# EAGLE design FubarStep_v10 (EAGLE 6.4)
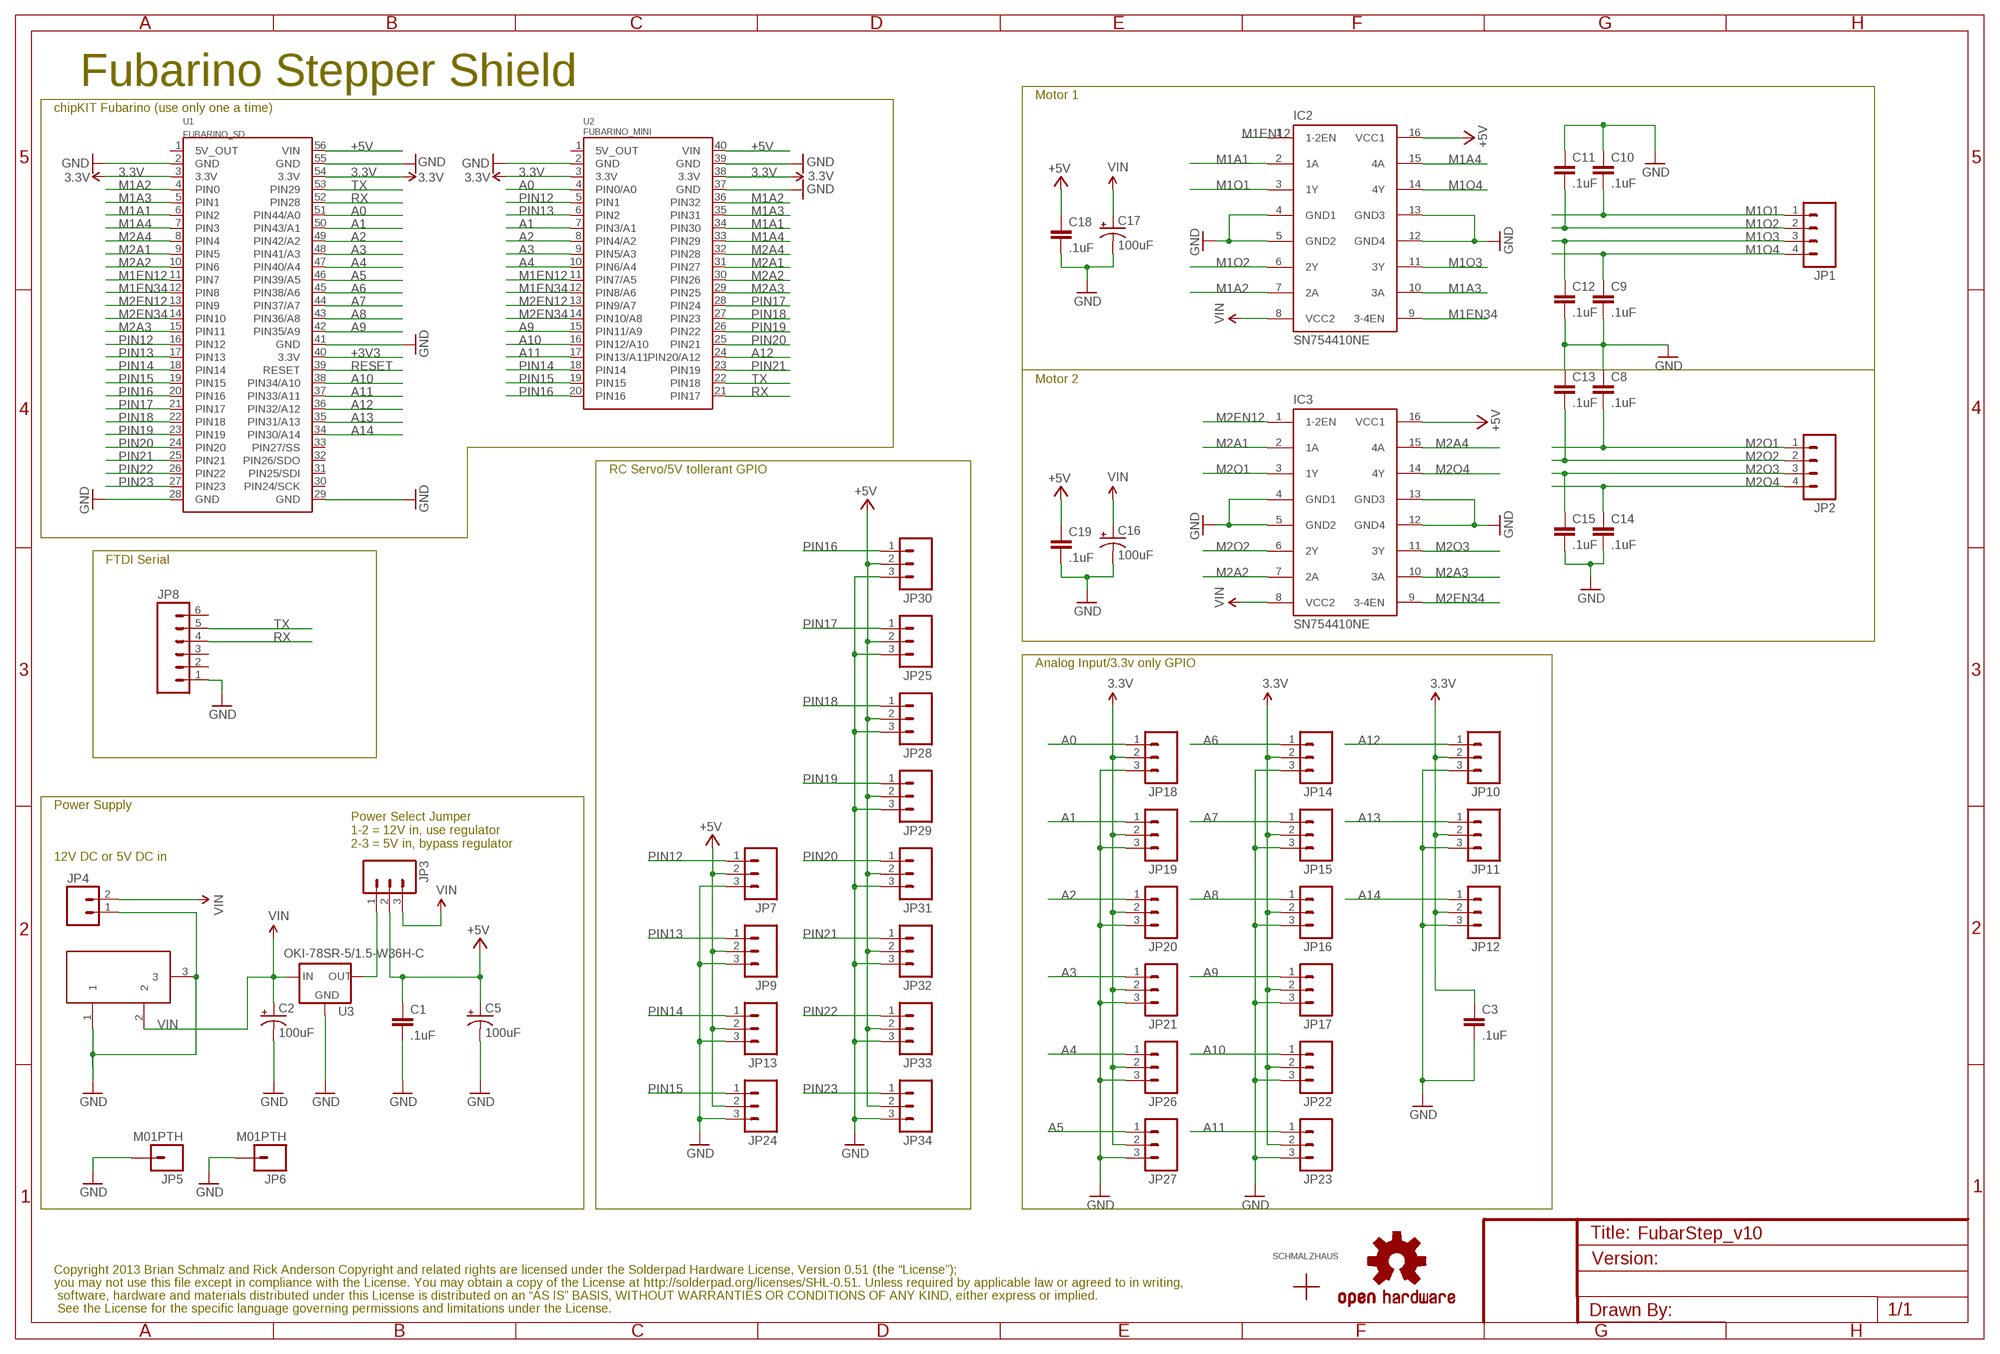
[diagram p0: schematic, sheet 1]

## Parts
C1  .1uF  CAPPTH  [CAP-PTH-SMALL]
C2  100uF  CAP_POLPTH1  [CPOL-RADIAL-100UF-25V]
C3  .1uF  CAPPTH  [CAP-PTH-SMALL]
C5  100uF  CAP_POLPTH1  [CPOL-RADIAL-100UF-25V]
C8  .1uF  CAPPTH  [CAP-PTH-SMALL]
C9  .1uF  CAPPTH  [CAP-PTH-SMALL]
C10  .1uF  CAPPTH  [CAP-PTH-SMALL]
C11  .1uF  CAPPTH  [CAP-PTH-SMALL]
C12  .1uF  CAPPTH  [CAP-PTH-SMALL]
C13  .1uF  CAPPTH  [CAP-PTH-SMALL]
C14  .1uF  CAPPTH  [CAP-PTH-SMALL]
C15  .1uF  CAPPTH  [CAP-PTH-SMALL]
C16  100uF  CAP_POLPTH1  [CPOL-RADIAL-100UF-25V]
C17  100uF  CAP_POLPTH1  [CPOL-RADIAL-100UF-25V]
C18  .1uF  CAPPTH  [CAP-PTH-SMALL]
C19  .1uF  CAPPTH  [CAP-PTH-SMALL]
IC2  SN754410NE  L293E  [DIL16]
IC3  SN754410NE  L293E  [DIL16]
JP1  M04SCREW_LOCK  [SCREWTERMINAL-3.5MM-4_LOCK]
JP2  M04SCREW_LOCK  [SCREWTERMINAL-3.5MM-4_LOCK]
JP3  M03PTH  [1X03]
JP4  M023.5MM  [SCREWTERMINAL-3.5MM-2]
JP5  M01PTH  [1X01]
JP6  M01PTH  [1X01]
JP7  M03PTH  [1X03]
JP8  M06LOCK  [1X06_LOCK]
JP9  M03PTH  [1X03]
JP10  M03PTH  [1X03]
JP11  M03PTH  [1X03]
JP12  M03PTH  [1X03]
JP13  M03PTH  [1X03]
JP14  M03PTH  [1X03]
JP15  M03PTH  [1X03]
JP16  M03PTH  [1X03]
JP17  M03PTH  [1X03]
JP18  M03PTH  [1X03]
JP19  M03PTH  [1X03]
JP20  M03PTH  [1X03]
JP21  M03PTH  [1X03]
JP22  M03PTH  [1X03]
JP23  M03PTH  [1X03]
JP24  M03PTH  [1X03]
JP25  M03PTH  [1X03]
JP26  M03PTH  [1X03]
JP27  M03PTH  [1X03]
JP28  M03PTH  [1X03]
JP29  M03PTH  [1X03]
JP30  M03PTH  [1X03]
JP31  M03PTH  [1X03]
JP32  M03PTH  [1X03]
JP33  M03PTH  [1X03]
JP34  M03PTH  [1X03]
LOGO1  OSHW-LOGOM  [OSHW-LOGO-M]
U1  FUBARINO_SD  [FUBARINO_SD]
U2  FUBARINO_MINI  [FUBARINO_MINI]
U3  OKI-78SR-5/1.5-W36H-C  V_REG_78XXSINK  [TO220-IGO]
U$1  SCHMALZHAUSSCHMALZHAUS_SMALL  [SCHMALZHAUS_SMALL]
X1  DC21MMX  [DC-21MM]

## Nets
3.3V: C3.1 JP10.2 JP11.2 JP12.2 JP14.2 JP15.2 JP16.2 JP17.2 JP18.2 JP19.2 JP20.2 JP21.2 JP22.2 JP23.2 JP26.2 JP27.2 U1.3(3.3V) U1.54(3.3V) U2.3(3.3V) U2.38(3.3V)
+3V3: U1.40(3.3V)
+5V: C1.1 C5.1(+) C18.1 C19.1 IC2.16(VCC1) IC3.16(VCC1) JP3.2 JP7.2 JP9.2 JP13.2 JP24.2 JP25.2 JP28.2 JP29.2 JP30.2 JP31.2 JP32.2 JP33.2 JP34.2 U1.56(VIN) U2.40(VIN)
A0: JP18.1 U1.51(PIN44/A0) U2.4(PIN0/A0)
A1: JP19.1 U1.50(PIN43/A1) U2.7(PIN3/A1)
A2: JP20.1 U1.49(PIN42/A2) U2.8(PIN4/A2)
A3: JP21.1 U1.48(PIN41/A3) U2.9(PIN5/A3)
A4: JP26.1 U1.47(PIN40/A4) U2.10(PIN6/A4)
A5: JP27.1 U1.46(PIN39/A5)
A6: JP14.1 U1.45(PIN38/A6)
A7: JP15.1 U1.44(PIN37/A7)
A8: JP16.1 U1.43(PIN36/A8)
A9: JP17.1 U1.42(PIN35/A9) U2.15(PIN11/A9)
A10: JP22.1 U1.38(PIN34/A10) U2.16(PIN12/A10)
A11: JP23.1 U1.37(PIN33/A11) U2.17(PIN13/A11)
A12: JP10.1 U1.36(PIN32/A12) U2.24(PIN20/A12)
A13: JP11.1 U1.35(PIN31/A13)
A14: JP12.1 U1.34(PIN30/A14)
GND: C1.2 C2.2(-) C3.2 C5.2(-) C8.1 C9.2 C10.1 C11.1 C12.2 C13.1 C14.2 C15.2 C16.2(-) C17.2(-) C18.2 C19.2 IC2.4(GND1) IC2.5(GND2) IC2.12(GND4) IC2.13(GND3) IC3.4(GND1) IC3.5(GND2) IC3.12(GND4) IC3.13(GND3) JP4.1 JP5.1 JP6.1 JP7.3 JP8.1 JP9.3 JP10.3 JP11.3 JP12.3 JP13.3 JP14.3 JP15.3 JP16.3 JP17.3 JP18.3 JP19.3 JP20.3 JP21.3 JP22.3 JP23.3 JP24.3 JP25.3 JP26.3 JP27.3 JP28.3 JP29.3 JP30.3 JP31.3 JP32.3 JP33.3 JP34.3 U1.2(GND) U1.28(GND) U1.29(GND) U1.41(GND) U1.55(GND) U2.2(GND) U2.37(GND) U2.39(GND) U3.GND X1.1 X1.3
M1A1: IC2.2(1A) U1.6(PIN2) U2.34(PIN30)
M1A2: IC2.7(2A) U1.4(PIN0) U2.36(PIN32)
M1A3: IC2.10(3A) U1.5(PIN1) U2.35(PIN31)
M1A4: IC2.15(4A) U1.7(PIN3) U2.33(PIN29)
M1EN12: IC2.1(1-2EN) U1.11(PIN7) U2.11(PIN7/A5)
M1EN34: IC2.9(3-4EN) U1.12(PIN8) U2.12(PIN8/A6)
M1O1: C10.2 IC2.3(1Y) JP1.1
M1O2: C11.2 IC2.6(2Y) JP1.2
M1O3: C12.1 IC2.11(3Y) JP1.3
M1O4: C9.1 IC2.14(4Y) JP1.4
M2A1: IC3.2(1A) U1.9(PIN5) U2.31(PIN27)
M2A2: IC3.7(2A) U1.10(PIN6) U2.30(PIN26)
M2A3: IC3.10(3A) U1.15(PIN11) U2.29(PIN25)
M2A4: IC3.15(4A) U1.8(PIN4) U2.32(PIN28)
M2EN12: IC3.1(1-2EN) U1.13(PIN9) U2.13(PIN9/A7)
M2EN34: IC3.9(3-4EN) U1.14(PIN10) U2.14(PIN10/A8)
M2O1: C8.2 IC3.3(1Y) JP2.1
M2O2: C13.2 IC3.6(2Y) JP2.2
M2O3: C15.1 IC3.11(3Y) JP2.3
M2O4: C14.1 IC3.14(4Y) JP2.4
N$2: JP3.1 U3.OUT
PIN12: JP7.1 U1.16(PIN12) U2.5(PIN1)
PIN13: JP9.1 U1.17(PIN13) U2.6(PIN2)
PIN14: JP13.1 U1.18(PIN14) U2.18(PIN14)
PIN15: JP24.1 U1.19(PIN15) U2.19(PIN15)
PIN16: JP30.1 U1.20(PIN16) U2.20(PIN16)
PIN17: JP25.1 U1.21(PIN17) U2.28(PIN24)
PIN18: JP28.1 U1.22(PIN18) U2.27(PIN23)
PIN19: JP29.1 U1.23(PIN19) U2.26(PIN22)
PIN20: JP31.1 U1.24(PIN20) U2.25(PIN21)
PIN21: JP32.1 U1.25(PIN21) U2.23(PIN19)
PIN22: JP33.1 U1.26(PIN22)
PIN23: JP34.1 U1.27(PIN23)
RESET: U1.39(RESET)
RX: JP8.4 U1.52(PIN28) U2.21(PIN17)
TX: JP8.5 U1.53(PIN29) U2.22(PIN18)
VIN: C2.1(+) C16.1(+) C17.1(+) IC2.8(VCC2) IC3.8(VCC2) JP3.3 JP4.2 U3.IN X1.2
Unconnected: JP8.2 JP8.3 JP8.6 U1.1(5V_OUT) U1.30(PIN24/SCK) U1.31(PIN25/SDI) U1.32(PIN26/SDO) U1.33(PIN27/SS) U2.1(5V_OUT)

## Notes on the sheet
- Fubarino Stepper Shield
- Motor 1
- chipKIT Fubarino (use only one a time)
- Motor 2
- RC Servo/5V tollerant GPIO
- FTDI Serial
- Analog Input/3.3v only GPIO
- Power Supply
- Power Select Jumper
  1-2 = 12V in, use regulator
  2-3 = 5V in, bypass regulator
- 12V DC or 5V DC in
- Copyright 2013 Brian Schmalz and Rick Anderson Copyright and related rights are licensed under the Solderpad Hardware License, Version 0.51 (the “License”);
- you may not use this file except in compliance with the License. You may obtain a copy of the License at http://solderpad.org/licenses/SHL-0.51. Unless required by applicable law or agreed to in writing,
- software, hardware and materials distributed under this License is distributed on an “AS IS” BASIS, WITHOUT WARRANTIES OR CONDITIONS OF ANY KIND, either express or implied.
- See the License for the specific language governing permissions and limitations under the License.

## Library data of the parts
C1 C3 C8-C15 C18 C19 = SparkFun-Capacitors:CAP: Capacitor Standard 0603 ceramic capacitor, and 0.1" leaded capacitor.
C2 C5 C16 C17 = SparkFun-Capacitors:CAP_POL: Capacitor Polarized These are standard SMD and PTH capacitors. Normally 10uF, 47uF, and 100uF in electrolytic and tantalum varieties. Always verify the external diameter of the through hole cap, it varies with capacity, voltage, and manufacturer. The EIA devices should be standard.
IC2 IC3 = texas:L293E: TI DEVICE; MF: Arrow Electronics; MPN: L293E; OC_FARNELL: 1467711; OC_NEWARK: 89K0732
JP1 JP2 = SparkFun-Connectors:M04: Header 4 Standard 4-pin 0.1" header. Use with straight break away headers (SKU : PRT-00116), right angle break away headers (PRT-00553), swiss pins (PRT-00743), machine pins (PRT-00117), and female headers (PRT-00115). Molex polarized connector foot print use with SKU : PRT-08231 with associated crimp pins and housings. 1MM SMD Version SKU: PRT-10208
JP3 JP7 JP9-JP34 = SparkFun-Connectors:M03: Header 3 Standard 3-pin 0.1" header. Use with straight break away headers (SKU : PRT-00116), right angle break away headers (PRT-00553), swiss pins (PRT-00743), machine pins (PRT-00117), and female headers (PRT-00115). Molex polarized connector foot print use with SKU : PRT-08232 with associated crimp pins and housings.
JP4 = SparkFun-Connectors:M02: Header 2 Standard 2-pin 0.1" header. Use with straight break away headers (SKU : PRT-00116), right angle break away headers (PRT-00553), swiss pins (PRT-00743), machine pins (PRT-00117), and female headers (PRT-00115). Molex polarized connector foot print use with SKU : PRT-08233 with associated crimp pins and housings.
JP5 JP6 = SparkFun-Connectors:M01: Header 1 Standard 1-pin 0.1" header. Use with straight break away headers (SKU : PRT-00116), right angle break away headers (PRT-00553), swiss pins (PRT-00743), machine pins (PRT-00117), and female headers (PRT-00115).
JP8 = SparkFun-Connectors:M06: Header 6 Standard 6-pin 0.1" header. Use with straight break away headers (SKU : PRT-00116), right angle break away headers (PRT-00553), swiss pins (PRT-00743), machine pins (PRT-00117), and female headers (PRT-00115). Molex polarized connector foot print use with SKU : PRT-08094 with associated crimp pins and housings. NOTES ON THE VARIANTS LOCK and LOCK_LONGPADS... This footprint was designed to help hold the alignment of a through-hole component (i.e. 6-pin header) while soldering it into place. You may notice that each hole has been shifted either up or down by 0.005 of an inch from it's more standard position (which is a perfectly straight line). This slight alteration caused the pins (the squares in the middle) to touch the edges of the holes. Because they are alternating, it causes a "brace" to hold the component in place. 0.005 has proven to be the perfect amount of "off-center" position when using our standard breakaway headers. Although looks a little odd when you look at the bare footprint, once you have a header in there, the alteration is very hard to notice. Also, if you push a header all the way into place, it is covered up entirely on the bottom side. This idea of altering the position of holes to aid alignment will be further integrated into the Sparkfun Library for other footprints. It can help hold any component with 3 or more connection pins.
LOGO1 = SparkFun-Aesthetics:OSHW-LOGO: Open Source Hardware Logo This logo indicates the piece of hardware it is found on incorporates a OSHW license and/or adheres to the definition of open source hardware found here: http://freedomdefined.org/OSHW
U1 = SchmalzHausPublic:FUBARINO_SD
U2 = SchmalzHausPublic:FUBARINO_MINI
U3 = SparkFun-PowerIC:V_REG_78XX: Voltage Regulator Standard 7805 5V regulator. IGO (Input Ground Output). Spark Fun Electronics SKU : COM-00107
U$1 = SchmalzHaus:SCHMALZHAUS
X1 = powersupply:DC21MM

## Net classes
0 default: width 0.152 mm, drill 0.305 mm, clearance 0.152 mm

## Board
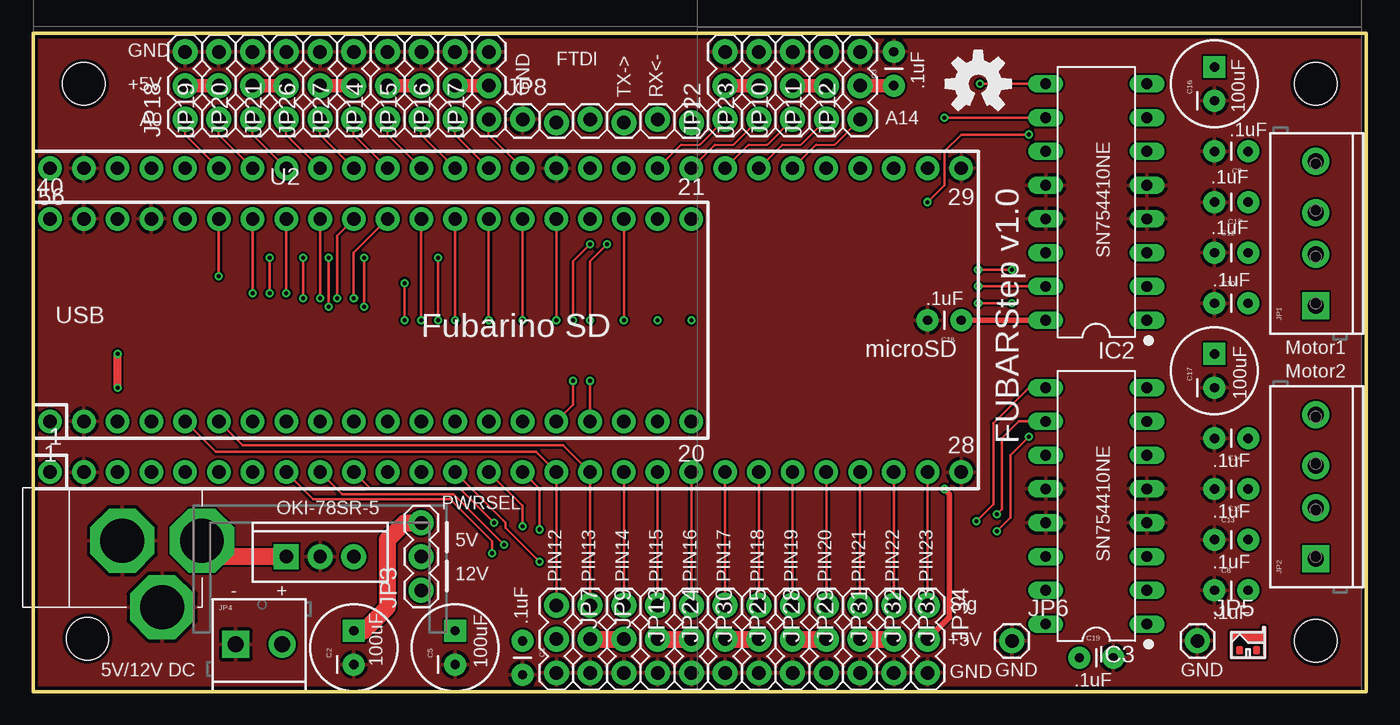
[diagram p1: board, top side]
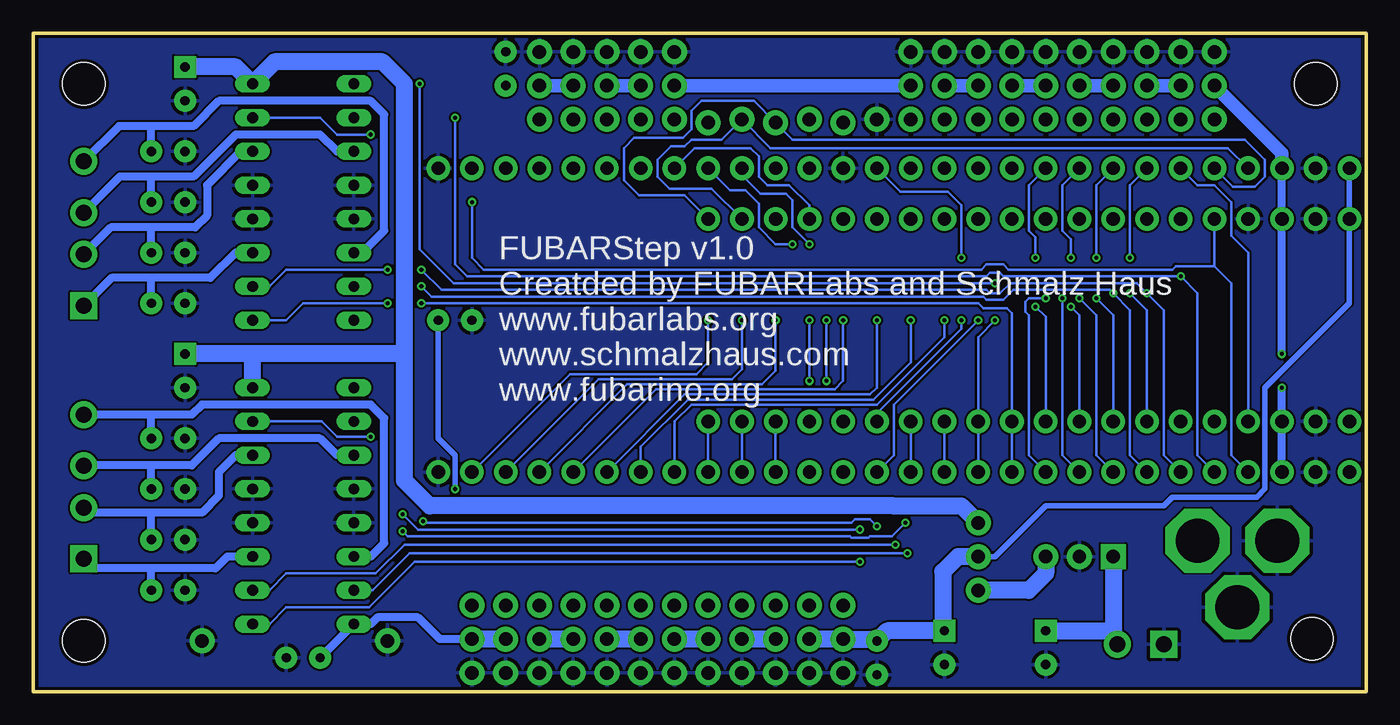
[diagram p2: board, bottom side, seen from below]

Size 100.33 x 49.53 mm. Coordinates in mm from the lower left corner, seen from the top.
Outline: 0,49.53 100.33,49.53 100.33,0 0,0 0,49.53
Copper layers (1*16): Top 0.035mm / dielectric 1.5mm / Bottom 0.035mm
Design rules "Fusion_eagle_rule_v1.1 *": minimum track width 6mil, minimum drill 12mil, track to track 6mil, track to pad 6mil, pad to pad 6mil, via to via 6mil, smd to smd 0mil, copper to edge 10mil, drill to drill 10mil, minimum pad ring 10mil, minimum via ring 6mil, stop-mask expansion 2mil, vias tented up to drill 100mil, thermal gap 10mil
Holes 3.2 mm at 96.52,45.72 96.52,3.81 3.81,45.72 4.08,3.98

### Footprints (pad centres in the part's own frame; a part is rotated, then mirrored left to right if it is on the bottom)
CAP-PTH-SMALL = drill 0.7 pad 1.651: 1 0,0; 2 2.54,0
CPOL-RADIAL-100UF-25V = drill 0.7 pad 1.651 square: 1 1.27,0 | drill 0.7 pad 1.651: 2 -1.27,0
DIL16 = drill 0.813 long: 1 -8.89,-3.81; 2 -6.35,-3.81; 3 -3.81,-3.81; 4 -1.27,-3.81; 5 1.27,-3.81; 6 3.81,-3.81; 7 6.35,-3.81; 8 8.89,-3.81; 9 8.89,3.81; 10 6.35,3.81; 11 3.81,3.81; 12 1.27,3.81; 13 -1.27,3.81; 14 -3.81,3.81; 15 -6.35,3.81; 16 -8.89,3.81
SCREWTERMINAL-3.5MM-4_LOCK = drill 1.2 pad 2.032 square: 1 -0.178,0 | drill 1.2 pad 2.032: 2 3.678,0; 3 6.822,0; 4 10.678,0
1X03 = drill 1.016 pad 1.88: 1 0,0; 2 2.54,0; 3 5.08,0
SCREWTERMINAL-3.5MM-2 = drill 1.2 pad 2.032 square: 1 0,0 | drill 1.2 pad 2.032: 2 3.5,0
1X01 = drill 1.016 pad 1.88: 1 0,0
1X06_LOCK = drill 1.016 pad 1.88: 1 0,0; 2 2.54,-0.254; 3 5.08,0; 4 7.62,-0.254; 5 10.16,0; 6 12.7,-0.254
FUBARINO_SD = drill 1 pad 1.778: 1 -34.29,-11.43; 2 -31.75,-11.43; 3 -29.21,-11.43; 4 -26.67,-11.43; 5 -24.13,-11.43; 6 -21.59,-11.43; 7 -19.05,-11.43; 8 -16.51,-11.43; 9 -13.97,-11.43; 10 -11.43,-11.43; 11 -8.89,-11.43; 12 -6.35,-11.43; 13 -3.81,-11.43; 14 -1.27,-11.43; 15 1.27,-11.43; 16 3.81,-11.43; 17 6.35,-11.43; 18 8.89,-11.43; 19 11.43,-11.43; 20 13.97,-11.43; 21 16.51,-11.43; 22 19.05,-11.43; 23 21.59,-11.43; 24 24.13,-11.43; 25 26.67,-11.43; 26 29.21,-11.43; 27 31.75,-11.43; 28 34.29,-11.43; 29 34.29,11.43; 30 31.75,11.43; 31 29.21,11.43; 32 26.67,11.43; 33 24.13,11.43; 34 21.59,11.43; 35 19.05,11.43; 36 16.51,11.43; 37 13.97,11.43; 38 11.43,11.43; 39 8.89,11.43; 40 6.35,11.43; 41 3.81,11.43; 42 1.27,11.43; 43 -1.27,11.43; 44 -3.81,11.43; 45 -6.35,11.43; 46 -8.89,11.43; 47 -11.43,11.43; 48 -13.97,11.43; 49 -16.51,11.43; 50 -19.05,11.43; 51 -21.59,11.43; 52 -24.13,11.43; 53 -26.67,11.43; 54 -29.21,11.43; 55 -31.75,11.43; 56 -34.29,11.43
FUBARINO_MINI = drill 1 pad 1.778: 1 -24.13,-7.62; 2 -21.59,-7.62; 3 -19.05,-7.62; 4 -16.51,-7.62; 5 -13.97,-7.62; 6 -11.43,-7.62; 7 -8.89,-7.62; 8 -6.35,-7.62; 9 -3.81,-7.62; 10 -1.27,-7.62; 11 1.27,-7.62; 12 3.81,-7.62; 13 6.35,-7.62; 14 8.89,-7.62; 15 11.43,-7.62; 16 13.97,-7.62; 17 16.51,-7.62; 18 19.05,-7.62; 19 21.59,-7.62; 20 24.13,-7.62; 21 24.13,7.62; 22 21.59,7.62; 23 19.05,7.62; 24 16.51,7.62; 25 13.97,7.62; 26 11.43,7.62; 27 8.89,7.62; 28 6.35,7.62; 29 3.81,7.62; 30 1.27,7.62; 31 -1.27,7.62; 32 -3.81,7.62; 33 -6.35,7.62; 34 -8.89,7.62; 35 -11.43,7.62; 36 -13.97,7.62; 37 -16.51,7.62; 38 -19.05,7.62; 39 -21.59,7.62; 40 -24.13,7.62
TO220-IGO = drill 1 pad 1.88: GND 0,0; OUT 2.54,0 | drill 1 pad 1.88 square: IN -2.54,0
DC-21MM = drill 3.302 pad 4.826 octagon: 1 -5.08,-3.353; 2 -0.076,-6.35; 3 -0.076,-0.356

### Placement (x,y rotation side)
C1  36.83,3.81 270 top
C2  24.13,3.3 90 top
C3  64.77,45.59 90 top
C5  31.75,3.3 90 top
C8  88.9,7.62 0 top
C9  91.44,40.64 180 top
C10  88.9,29.21 0 top
C11  88.9,33.02 0 top
C12  91.44,36.83 180 top
C13  88.9,11.43 0 top
C14  91.44,19.05 180 top
C15  91.44,15.24 180 top
C16  88.9,45.72 90 top
C17  88.9,24.13 90 top
C18  69.85,27.94 180 top
C19  78.74,2.54 0 top
IC2  80.01,36.83 90 top
IC3  80.01,13.97 90 top
JP1  96.52,29.21 90 top
JP2  96.52,10.16 90 top
JP3  29.21,7.62 90 top
JP4  15.24,3.56 0 top
JP5  87.63,3.81 0 top
JP6  73.66,3.81 0 top
JP7  39.37,6.48 270 top
JP8  36.83,43.05 0 top
JP9  41.91,6.48 270 top
JP10  57.15,43.05 90 top
JP11  59.69,43.05 90 top
JP12  62.23,43.05 90 top
JP13  44.45,6.48 270 top
JP14  26.67,43.05 90 top
JP15  29.21,43.05 90 top
JP16  31.75,43.05 90 top
JP17  34.29,43.05 90 top
JP18  11.43,43.05 90 top
JP19  13.97,43.05 90 top
JP20  16.51,43.05 90 top
JP21  19.05,43.05 90 top
JP22  52.07,43.05 90 top
JP23  54.61,43.05 90 top
JP24  46.99,6.48 270 top
JP25  52.07,6.48 270 top
JP26  21.59,43.05 90 top
JP27  24.13,43.05 90 top
JP28  54.61,6.48 270 top
JP29  57.15,6.48 270 top
JP30  49.53,6.48 270 top
JP31  59.69,6.48 270 top
JP32  62.23,6.48 270 top
JP33  64.77,6.48 270 top
JP34  67.31,6.48 270 top
LOGO1  71.12,45.72 0 top
U1  35.56,27.94 0 top
U2  25.4,27.94 0 top
U3  21.59,10.16 0 top
U$1  91.44,2.54 0 top
X1  6.35,11.43 90 top

### Tracks (layer width: path | path; a pad name or v marks a point on that pad's centre or on a via)
3.3V  (via drill 0.3)
  Top 0.61: v6.35,22.86 v6.35,25.4
  Top 1.016: C3.1 JP12.2 | JP11.2 JP10.2 | JP23.2 JP22.2 | JP17.2 JP16.2 | JP15.2 JP14.2 | JP27.2 JP26.2 | JP21.2 JP20.2 | JP19.2 JP18.2
  Bottom 0.61: U1.3 U2.3 v6.35,22.86 | U1.54 U2.38 v6.35,25.4
  Bottom 1.016: U1.54 6.35,40.51 JP18.2 | JP19.2 JP20.2 | JP21.2 JP26.2 | JP27.2 JP14.2 | JP15.2 JP16.2 | JP17.2 JP22.2 | JP23.2 JP10.2 | JP11.2 JP12.2
+5V  (via drill 0.3)
  Top 0.406: JP34.2 68.96,5.59 68.96,14.86 v68.58,15.24 | C18.1 IC2.16
  Top 1.27: JP9.2 JP13.2 | JP24.2 JP30.2 | JP25.2 JP28.2 | JP29.2 JP31.2 | JP32.2 JP33.2
  Bottom 0.203: 31.88,4.7 C5.1 | 36.96,3.94 C1.1
  Bottom 0.406: U1.56 U2.40 1.27,29.21 7.62,22.86 7.62,15.24 8.26,14.61 14.61,14.61 15.24,13.97 24.13,13.97 27.94,10.16 JP3.2 | v68.58,15.24 68.58,17.78 69.85,19.05 C18.1
  Bottom 0.61: JP34.2 69.72,3.94 71.37,5.59 74.42,5.59 74.93,5.08 IC3.16 C19.1
  Bottom 1.27: JP9.2 JP7.2 36.96,3.94 | JP13.2 JP24.2 | JP30.2 JP25.2 | JP28.2 JP29.2 | JP31.2 JP32.2 | JP33.2 JP34.2 | JP3.2 30.73,10.16 31.88,9.02 31.88,4.7 | C5.1 36.07,4.57 C1.1
A0
  Top 0.152: U1.51 11.43,41.91 JP18.1
  Bottom 0.203: U2.4 8.89,33.02 10.16,34.29 10.16,36.83 11.43,38.1 12.7,38.1 U1.51
A1  (via drill 0.3)
  Top 0.152: U1.50 13.97,41.91 JP19.1
  Top 0.203: v17.78,29.97 v17.78,32.64
  Bottom 0.203: U2.7 16.51,28.7 v17.78,29.97 | v17.78,32.64 17.78,38.1 U1.50
A2  (via drill 0.3)
  Top 0.152: U1.49 16.51,41.91 JP20.1
  Top 0.203: v20.32,29.59 v20.32,32.64
  Bottom 0.203: U2.8 19.05,28.32 v20.32,29.59 | v20.32,32.64 20.32,38.1 U1.49
A3  (via drill 0.3)
  Top 0.152: U1.48 19.05,41.91 JP21.1
  Top 0.203: v22.23,28.96 v22.23,32.64
  Bottom 0.203: U2.9 21.59,28.32 v22.23,28.96 | v22.23,32.64 22.23,34.04 22.86,34.67 22.86,38.1 U1.48
A4  (via drill 0.3)
  Top 0.152: U1.47 21.59,41.91 JP26.1
  Top 0.203: v24.89,28.96 v24.89,32.64
  Bottom 0.203: U2.10 24.13,28.19 v24.89,28.96 | v24.89,32.64 24.89,34.16 25.4,34.67 25.4,38.1 U1.47
A5
  Top 0.152: U1.46 24.13,41.91 JP27.1
A6
  Top 0.152: U1.45 26.67,41.91 JP14.1
A7
  Top 0.152: U1.44 29.21,41.91 JP15.1
A8
  Top 0.152: U1.43 31.75,41.91 JP16.1
A9  (via drill 0.3)
  Top 0.152: U1.42 34.29,41.91 JP17.1
  Top 0.203: v30.48,27.94 v30.48,32.64
  Bottom 0.203: U2.15 36.83,20.95 30.48,27.3 v30.48,27.94 | v30.48,32.64 30.48,36.58 31.5,37.59 35.05,37.59 U1.42
A10  (via drill 0.3)
  Top 0.152: U1.38 48.77,41.15 50.16,41.15 JP22.1
  Top 0.203: U2.16 40.64,21.59 v40.64,23.37 | v40.64,27.94 40.64,32.38 v41.91,33.66
  Bottom 0.203: v40.64,23.37 v40.64,27.94 | v41.91,33.66 43.18,34.92 43.18,36.96 43.69,37.47 45.59,37.47 46.99,38.86 U1.38
A11  (via drill 0.3)
  Top 0.152: U1.37 51.31,41.15 52.7,41.15 JP23.1
  Top 0.203: U2.17 v41.91,23.37 | v41.91,27.94 41.91,32.38 v43.18,33.66
  Bottom 0.203: v41.91,23.37 v41.91,27.94 | v43.18,33.66 44.45,33.66 45.72,34.92 45.72,36.7 46.74,37.72 47.88,37.72 U1.37
A12
  Top 0.152: U1.36 53.85,41.15 55.24,41.15 JP10.1
  Bottom 0.203: U2.24 41.91,36.58 43.43,38.1 45.09,38.1 45.72,38.73 45.72,40.26 46.35,40.89 50.55,40.89 U1.36
A13
  Top 0.152: U1.35 56.39,41.15 57.78,41.15 JP11.1
A14
  Top 0.152: U1.34 58.93,41.15 60.33,41.15 JP12.1
GND
  pour Bottom (rank 2): 0,49.53 100.33,49.53 100.33,0 0,0
  pour Top (rank 2): 0,49.53 100.33,49.53 100.33,0 0,0
M1A1  (via drill 0.3)
  Top 0.203: v73.66,31.75 v71.12,31.75 | U2.34 v16.51,29.97
  Bottom 0.203: IC2.2 82.55,30.48 81.28,31.75 v73.66,31.75 | v71.12,31.75 69.6,30.23 28.57,30.23 28.32,29.97 27.56,29.97 26.8,30.73 17.27,30.73 v16.51,29.97 15.24,28.7 15.24,17.78 U1.6
M1A2  (via drill 0.3)
  Top 0.203: v74.93,41.91 69.85,41.91 68.58,40.64 68.58,38.1 v67.31,36.83
  Bottom 0.203: IC2.7 78.74,43.18 77.47,41.91 v74.93,41.91 | v67.31,36.83 67.31,32.64 66.42,31.75 28.96,31.75 28.57,32.13 27.3,32.13 26.92,31.75 14.61,31.75 14.35,32 11.43,32 | U1.4 10.16,17.78 10.16,30.73 11.43,32 | 11.43,32 U2.36
M1A3  (via drill 0.3)
  Top 0.203: IC2.10 v68.58,43.18 | U2.35 v13.97,31.24
  Bottom 0.203: v68.58,43.18 68.58,32.13 67.69,31.24 28.57,31.24 28.32,31.5 27.56,31.5 27.3,31.24 v13.97,31.24 12.7,29.97 12.7,17.78 U1.5
M1A4  (via drill 0.3)
  Top 0.203: IC2.15 v71.12,30.48 | U2.33 v19.05,29.97
  Bottom 0.203: v71.12,30.48 70.36,29.72 28.83,29.72 28.57,29.46 27.3,29.46 26.54,30.23 19.3,30.23 v19.05,29.97 17.78,28.7 17.78,17.78 U1.7
M1EN12  (via drill 0.3)
  Top 0.203: v73.66,29.21 v71.12,29.21
  Bottom 0.203: IC2.1 81.28,27.94 80.01,29.21 v73.66,29.21 | v71.12,29.21 29.21,29.21 28.83,28.83 27.05,28.83 26.67,28.45 U2.11 U1.11
M1EN34  (via drill 0.3)
  Top 0.203: IC2.9 v71.25,45.72 | v27.94,27.94 v27.94,30.73
  Bottom 0.203: v71.25,45.72 71.25,33.27 68.71,30.73 v27.94,30.73 | U1.12 U2.12 29.21,26.67 v27.94,27.94
M1O1
  Bottom 0.61: IC2.3 85.09,33.02 87,31.11 91.44,31.11 | 91.44,31.11 94.44,31.11 JP1.1 | C10.2 91.44,31.11
M1O2
  Bottom 0.61: IC2.6 84.71,40.64 87.25,38.1 87.25,35.81 88.14,34.92 91.44,34.92 | 91.44,34.92 94.48,34.92 JP1.2 | C11.2 91.44,34.92
M1O3
  Bottom 0.61: IC2.11 77.47,40.64 78.74,41.91 85.09,41.91 88.27,38.73 91.31,38.73 | 91.31,38.73 93.82,38.73 JP1.3 | C12.1 91.44,38.61 91.31,38.73
M1O4
  Bottom 0.61: IC2.14 75.56,33.02 73.91,34.67 73.91,43.43 74.93,44.45 86.36,44.45 88.27,42.55 91.31,42.55 | 91.31,42.55 93.86,42.55 JP1.4 | C9.1 91.44,42.42 91.31,42.55
M2A1  (via drill 0.3)
  Top 0.203: U1.9 23.24,14.86 31.62,14.86 v35.43,11.05 | U2.31 22.86,34.29 v22.86,29.59
  Bottom 0.203: IC3.2 82.55,7.62 81.28,8.89 74.55,8.89 72.39,11.05 v35.43,11.05 | v22.86,29.59 22.86,17.78 U1.9
M2A2  (via drill 0.3)
  Top 0.203: v74.93,19.18 73.53,17.78 73.53,13.08 v72.52,12.06 | U1.10 25.4,15.24 32.13,15.24 v34.67,12.7 | U2.30 24.13,33.02 v24.13,29.59
  Bottom 0.203: IC3.7 78.61,20.32 77.47,19.18 v74.93,19.18 | v72.52,12.06 72.14,11.68 38.86,11.68 38.73,11.56 37.47,11.56 37.34,11.68 35.69,11.68 v34.67,12.7 | U1.10 25.4,17.78 25.4,28.32 25.65,28.57 25.65,29.34 25.4,29.59 v24.13,29.59
M2A3  (via drill 0.3)
  Top 0.203: IC3.10 74.17,20.32 72.9,19.05 72.9,13.72 v72.52,13.34 | v38.1,12.19 38.1,15.24 U1.15 | v29.21,27.94 U2.29
  Bottom 0.203: v72.52,13.34 71.37,12.19 v38.1,12.19 | U1.15 35.56,17.78 35.56,21.59 v29.21,27.94
M2A4  (via drill 0.3)
  Top 0.203: U1.8 21.08,14.48 31.37,14.48 34.54,11.3 v34.54,10.41 | U2.32 v21.59,29.59
  Bottom 0.203: IC3.15 74.8,7.62 72.01,10.41 v34.54,10.41 | v21.59,29.59 20.32,28.32 20.32,17.78 U1.8
M2EN12  (via drill 0.3)
  Top 0.203: v38.1,9.78 35.56,12.32 35.56,12.7 U1.13
  Bottom 0.203: IC3.1 82.55,5.08 81.28,6.35 75.06,6.35 71.63,9.78 v38.1,9.78 | U2.13 U1.13
M2EN34  (via drill 0.3)
  Top 0.203: IC3.9 74.93,22.86 72.26,20.19 72.26,14.1 v70.99,12.83 | v36.83,12.45 36.83,13.97 U1.14
  Bottom 0.203: v70.99,12.83 70.87,12.7 38.73,12.7 38.48,12.95 37.34,12.95 v36.83,12.45 | U2.14 U1.14
M2O1
  Bottom 0.61: IC3.3 85.72,10.16 86.61,9.27 91.44,9.27 | 91.44,9.27 95.81,9.27 JP2.1 | C8.2 91.44,9.27
M2O2
  Bottom 0.406: 96.13,13.46 96.14,13.46 JP2.2
  Bottom 0.61: IC3.6 85.09,17.78 86.36,16.51 86.36,14.73 87.63,13.46 91.44,13.46 | 91.44,13.46 96.13,13.46 | C13.2 91.44,13.46
M2O3
  Bottom 0.406: JP2.3 96.47,16.98 96.43,17.02
  Bottom 0.61: IC3.11 77.47,17.78 78.74,19.05 86.36,19.05 88.39,17.02 91.44,17.02 | 91.44,17.02 96.43,17.02 | C15.1 91.44,17.02
M2O4
  Bottom 0.406: 96,20.83 96.51,20.83 JP2.4
  Bottom 0.61: IC3.14 74.93,10.16 73.91,11.18 73.91,20.57 74.93,21.59 87.63,21.59 88.39,20.83 91.44,20.83 | 91.44,20.83 96,20.83 | C14.1 91.44,20.83
N$2
  Bottom 1.27: U3.OUT 24.13,8.89 25.4,7.62 JP3.1
PIN12
  Top 0.203: JP7.1 U1.16 37.85,18.03 13.72,18.03 U2.5
PIN13
  Top 0.203: JP9.1 U1.17 39.88,18.54 15.75,18.54 U2.6
PIN14
  Top 0.203: U1.18 JP13.1
  Bottom 0.203: U2.18 U1.18
PIN15
  Top 0.203: U1.19 JP24.1
  Bottom 0.203: U2.19 U1.19
PIN16
  Top 0.203: JP30.1 U1.20
  Bottom 0.203: U2.20 U1.20
PIN17  (via drill 0.3)
  Top 0.203: JP25.1 U1.21 | U2.28 v31.75,27.94
  Bottom 0.203: v31.75,27.94 31.75,26.67 36.83,21.59 50.8,21.59 52.07,20.32 U1.21
PIN18  (via drill 0.3)
  Top 0.203: U1.22 JP28.1 | U2.27 v34.29,27.94
  Bottom 0.203: v34.29,27.94 34.29,24.77 37.08,21.97 51.05,21.97 54.61,18.41 U1.22
PIN19  (via drill 0.3)
  Top 0.203: JP29.1 U1.23 | U2.26 v36.83,27.94
  Bottom 0.203: v36.83,27.94 36.83,22.86 37.34,22.35 51.31,22.35 U1.23
PIN20  (via drill 0.3)
  Top 0.203: U1.24 JP31.1 | U2.25 v39.37,27.94
  Bottom 0.203: v39.37,27.94 39.37,23.37 40.01,22.73 53.47,22.73 U1.24
PIN21  (via drill 0.3)
  Top 0.203: JP32.1 U1.25 | U2.23 v44.45,27.94
  Bottom 0.203: v44.45,27.94 44.45,24.13 45.47,23.11 55.63,23.11 U1.25
PIN22  (via drill 0.3)
  Top 0.203: U1.26 JP33.1
  Bottom 0.203: v46.99,27.94 46.99,24.26 47.75,23.5 57.78,23.5 U1.26
PIN23  (via drill 0.3)
  Top 0.203: JP34.1 U1.27
  Bottom 0.203: v49.53,27.94 49.53,24.77 50.42,23.88 59.94,23.88 U1.27
RX
  Bottom 0.203: U2.21 51.31,37.34 54.74,37.34 55.88,38.48 55.88,40.89 55.12,41.66 51.44,41.66 50.8,42.29 50.8,43.69 50.04,44.45 46.1,44.45 JP8.4 43.18,41.53 9.14,41.53 7.62,40.01 7.62,38.73 8.38,37.97 10.03,37.97 U1.52
TX
  Bottom 0.203: U1.53 10.41,40.89 44.83,40.89 JP8.5 48.51,41.53 50.8,41.53 51.31,41.02 52.32,41.02 53.34,40.01 53.34,38.73 52.45,37.85 49.28,37.85 U2.22
VIN
  Top 1.27: X1.2 13.89,10.16 U3.IN | C2.1 24.89,4.57 26.67,6.35 26.67,11.43 27.94,12.7 JP3.3
  Bottom 0.152: X1.2 12.7,11.43
  Bottom 0.203: 19.05,3.87 JP4.2
  Bottom 1.27: 72.39,25.4 72.39,15.88 70.48,13.97 35.56,13.97 30.48,13.97 JP3.3 | 72.39,25.4 83.82,25.4 | 83.82,25.4 C17.1 | 72.39,25.4 72.39,45.72 74.04,47.37 82.17,47.37 IC2.8 85.09,46.99 C16.1 | IC3.8 83.82,25.4 | U3.IN 19.05,4.57 | 19.05,4.57 19.05,3.87 | C2.1 19.05,4.57

### Text on the board
tPlace: GND | FTDI | +5V | GND | TX-> | RX<- | .1uF | 100uF | A0 | A14 | .1uF | .1uF | .1uF | SN754410NE | .1uF | .1uF | Motor1 | Motor2 | 100uF | FUBARStep v1.0 | .1uF | PWRSEL | OKI-78SR-5 | .1uF | 5V | SN754410NE | .1uF | 12V | PIN12 | PIN13 | PIN14 | PIN15 | PIN16 | PIN17 | PIN18 | PIN19 | PIN20 | PIN21 | PIN22 | PIN23 | - | + | Sig | .1uF | .1uF | +5V | 100uF | 100uF | 5V/12V DC | GND | GND | GND | .1uF
bPlace: FUBARStep v1.0 / Creatded by FUBARLabs and Schmalz Haus / www.fubarlabs.org / www.schmalzhaus.com / www.fubarino.org
Document: ANALOG INPUTS/3.3V GPIO | FTDI | SERVO OUTPUTS/5V GPIO
214bmp: D:/SmartProjects/Snc/a4_bn_logo2.bmp